# EAGLE design uno (EAGLE 9.2.2)
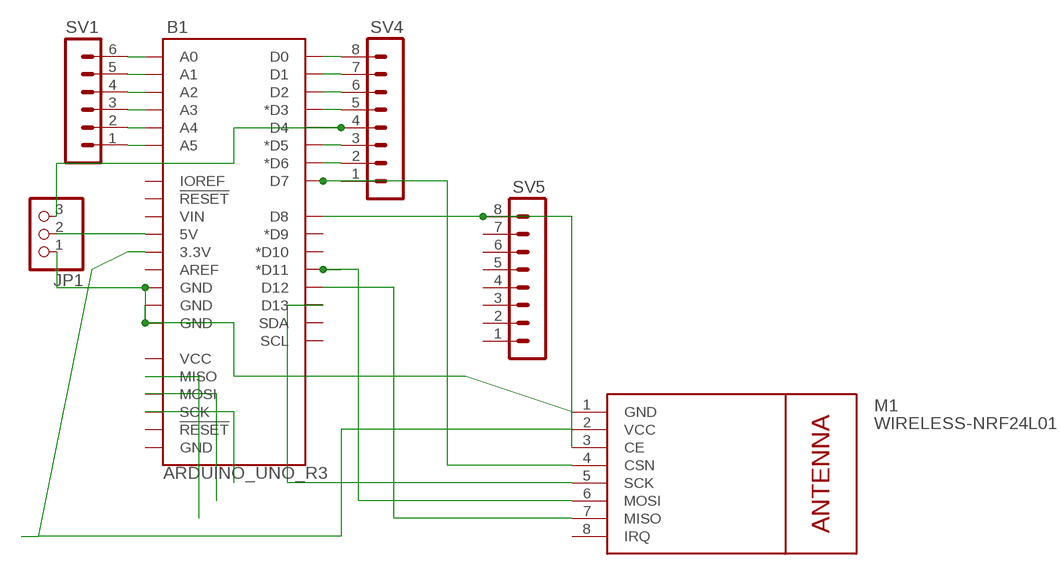
[diagram p0: schematic, sheet 1]

## Parts
B1  ARDUINO_UNO_R3  [ARDUINO_R3]
JP1  PINHD-1X3  [1X03]
M1  WIRELESS-NRF24L01  [WIRELESS-NRF24L01]
SV1  MA06-1  [MA06-1]
SV4  MA08-1  [MA08-1]
SV5  MA08-1  [MA08-1]

## Nets
N$1: B1.A5 SV1.1
N$2: B1.A4 SV1.2
N$3: B1.A3 SV1.3
N$4: B1.A2 SV1.4
N$5: B1.A1 SV1.5
N$6: B1.A0 SV1.6
N$9: B1.SCK
N$10: B1.MOSI
N$11: B1.MISO
N$17: B1.3.3V M1.2(VCC)
N$20: B1.D13 M1.5(SCK)
N$21: B1.D11(*D11) M1.6(MOSI)
N$22: B1.D12 M1.7(MISO)
N$27: B1.5V JP1.2
N$28: B1.GND@2(GND) B1.GND@3(GND) B1.GND@4(GND) JP1.1 M1.1(GND)
N$29: B1.D8 M1.3(CE) SV5.8
N$30: B1.D7 M1.4(CSN) SV4.1
N$31: B1.D6(*D6) SV4.2
N$32: B1.D5(*D5) SV4.3
N$33: B1.D4 JP1.3 SV4.4
N$34: B1.D3(*D3) SV4.5
N$35: B1.D2 SV4.6
N$36: B1.D1 SV4.7
N$37: B1.D0 SV4.8
Unconnected: B1.AREF B1.D9(*D9) B1.D10(*D10) B1.GND@1(GND) B1.IOREF B1.RESET@1(!RESET!) B1.RESET@2(!RESET!) B1.SCL B1.SDA B1.VCC B1.VIN M1.8(IRQ) SV5.1 SV5.2 SV5.3 SV5.4 SV5.5 SV5.6 SV5.7

## Library data of the parts
B1 = Arduino:ARDUINO_UNO_R3: Arduino R3 Footprint with SPI header Arduino Uno R3 Compatible Footprint. Matches PCB size of the original board. SparkFun Products: SAMD21 Dev Breakout <https://www.sparkfun.com/products/13672> RedBoard <https://www.sparkfun.com/products/12757> R3 Stackable Headers <https://www.sparkfun.com/products/11417>
JP1 = pinhead:PINHD-1X3: PIN HEADER
M1 = diy-modules:WIRELESS-NRF24L01: 2.4 GHz Wireless Module based on NRF24L01 chip More details available here: http://www.electrodragon.com/w/NRF24L01 Click here to find device on ebay.com <http://www.ebay.com/sch/nrf24l01+arduino>
SV1 = con-lstb:MA06-1: PIN HEADER; OC_FARNELL: unknown; OC_NEWARK: unknown
SV4 SV5 = con-lstb:MA08-1: PIN HEADER; OC_FARNELL: unknown; OC_NEWARK: unknown

## Board
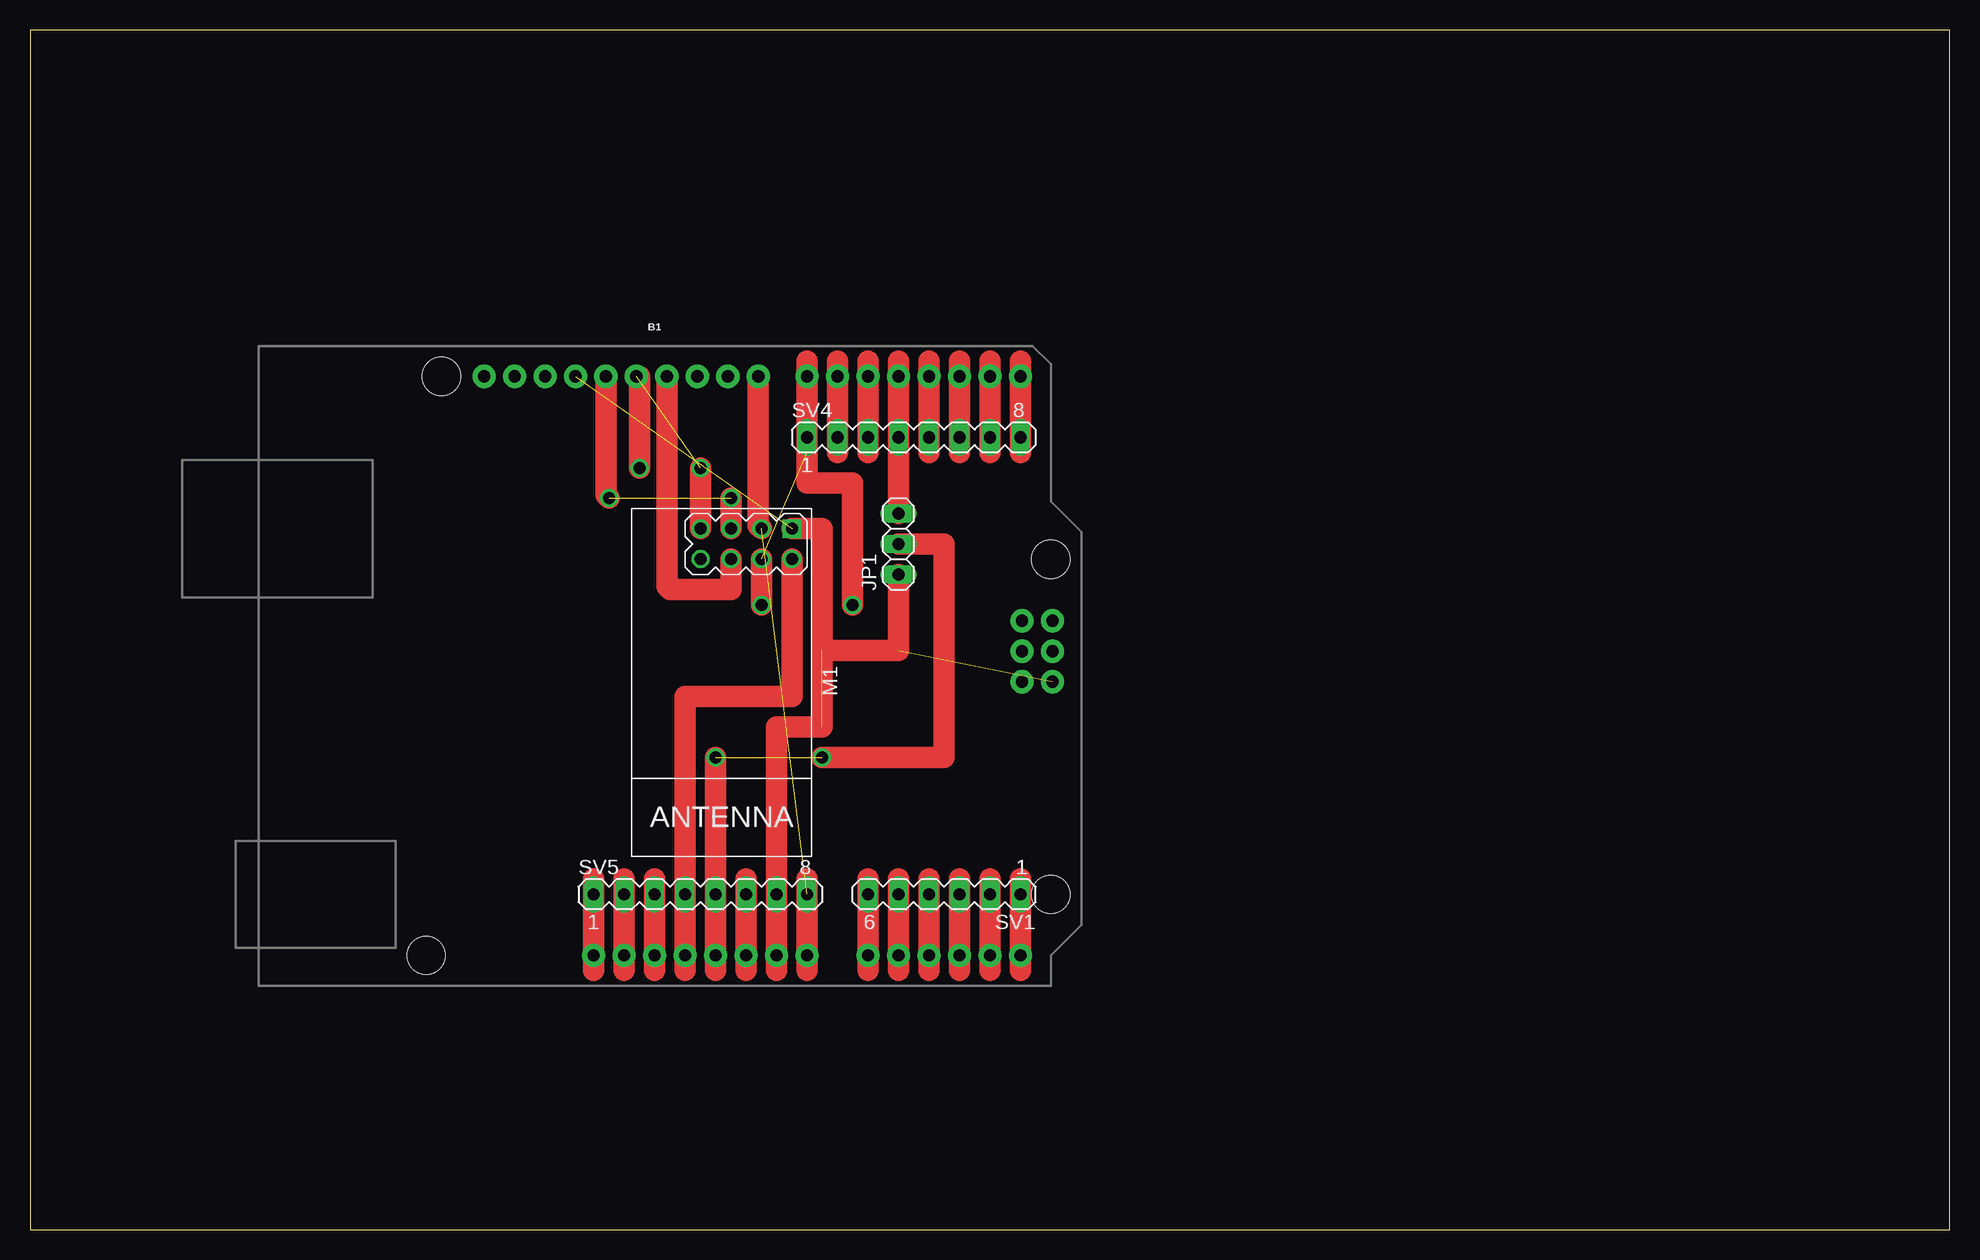
[diagram p1: board, top side]
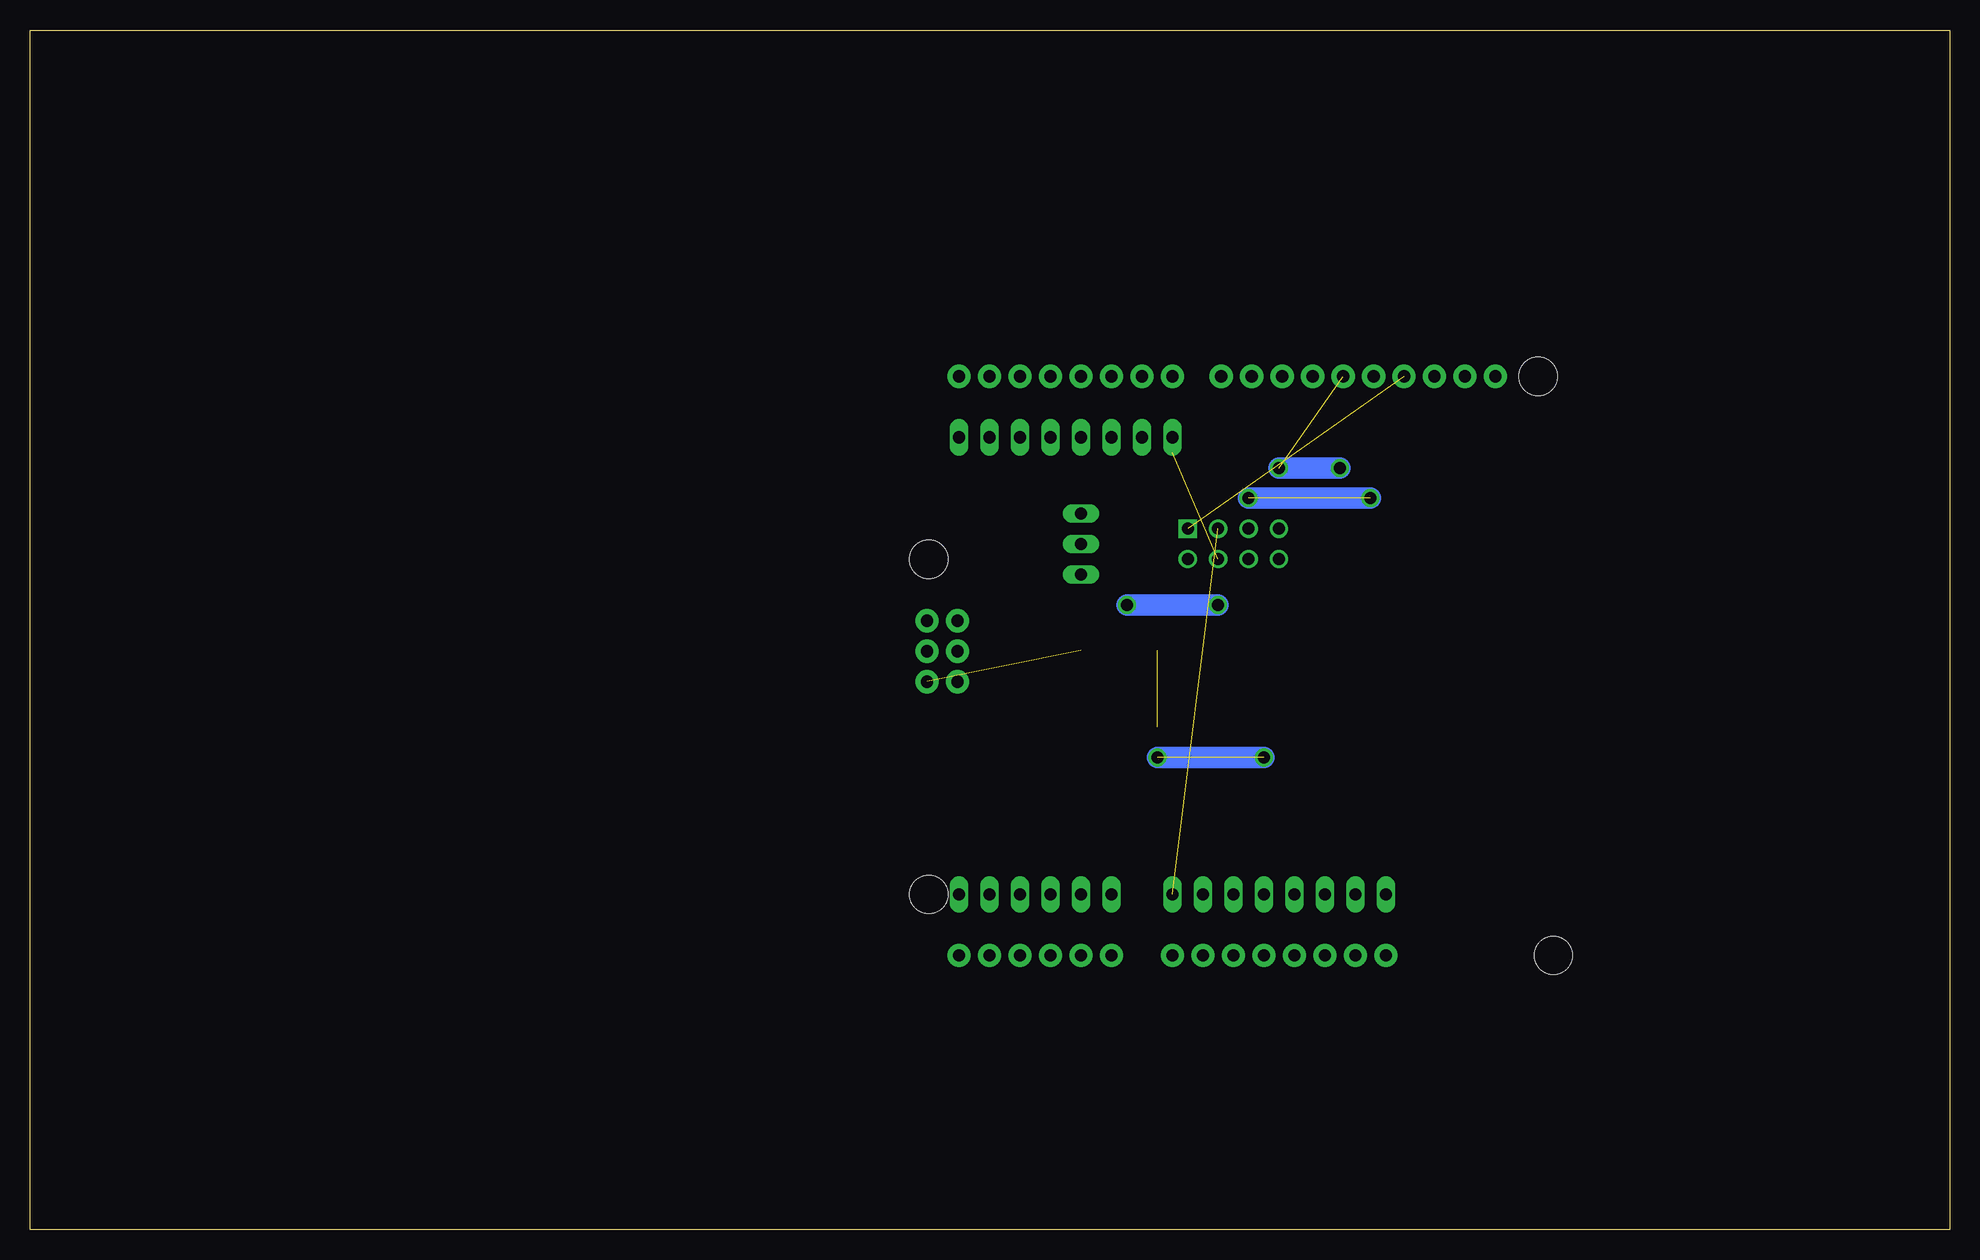
[diagram p2: board, bottom side, seen from below]

Size 160 x 100 mm. Coordinates in mm from the lower left corner, seen from the top.
Outline: 0,0 160,0 160,100 0,100 0,0
Copper layers (1*16): Top 0.035mm / dielectric 1.5mm / Bottom 0.035mm
Design rules "default": minimum track width 6mil, minimum drill 0.35mm, track to track 6mil, track to pad 6mil, pad to pad 6mil, via to via 6mil, smd to smd 6mil, copper to edge 40mil, drill to drill 6mil, minimum pad ring 10mil, minimum via ring 8mil, stop-mask expansion 4mil, vias tented up to drill 0mil, thermal gap 10mil

### Footprints (pad centres in the part's own frame; a part is rotated, then mirrored left to right if it is on the bottom)
ARDUINO_R3 = drill 1.016 pad 1.93: 3.3V 2.54,-24.13; 5V 5.08,-24.13; A0 17.78,-24.13; A1 20.32,-24.13; A2 22.86,-24.13; A3 25.4,-24.13; A4 27.94,-24.13; A5 30.48,-24.13; AREF -9.144,24.13; D0 30.48,24.13; D1 27.94,24.13; D2 25.4,24.13; D3 22.86,24.13; D4 20.32,24.13; D5 17.78,24.13; D6 15.24,24.13; D7 12.7,24.13; D8 8.636,24.13; D9 6.096,24.13; D10 3.556,24.13; D11 1.016,24.13; D12 -1.524,24.13; D13 -4.064,24.13; GND@1 7.62,-24.13; GND@2 10.16,-24.13; GND@3 -6.604,24.13; GND@4 33.16,-1.32; IOREF -2.54,-24.13; MISO 30.62,3.76; MOSI 33.16,1.22; NC -5.08,-24.13; RESET@1 0,-24.13; RESET@2 30.62,-1.32; SCK 30.62,1.22; SCL -14.224,24.13; SDA -11.684,24.13; VCC 33.16,3.76; VIN 12.7,-24.13 | hole 3.175: -17.78,24.13; 33.02,8.89; 33.02,-19.05; -19.05,-24.13
1X03 = drill 1.016 long: 1 -2.54,0; 2 0,0; 3 2.54,0
WIRELESS-NRF24L01 = drill 1 square: 1 -12.7,6.35 | drill 1: 2 -10.16,6.35; 3 -12.7,3.81; 4 -10.16,3.81; 5 -12.7,1.27; 6 -10.16,1.27; 7 -12.7,-1.27; 8 -10.16,-1.27
MA06-1 = drill 1.016 long: 1 -6.35,0; 2 -3.81,0; 3 -1.27,0; 4 1.27,0; 5 3.81,0; 6 6.35,0
MA08-1 = drill 1.016 long: 1 -8.89,0; 2 -6.35,0; 3 -3.81,0; 4 -1.27,0; 5 1.27,0; 6 3.81,0; 7 6.35,0; 8 8.89,0

### Placement (x,y rotation side)
B1  52.07,46.99 0 top
JP1  72.39,57.15 90 top
M1  57.15,45.72 270 top
SV1  76.2,27.94 180 top
SV4  73.66,66.04 0 top
SV5  55.88,27.94 0 top

### Tracks (layer width: path | path; a pad name or v marks a point on that pad's centre or on a via)
N$1
  Top 1.778: 82.55,29.21 SV1.1 B1.A5 82.55,21.59
N$2
  Top 1.778: 80.01,21.59 B1.A4 SV1.2 80.01,29.21
N$3
  Top 1.778: 77.47,29.21 SV1.3 B1.A3 77.47,21.59
N$4
  Top 1.778: 74.93,21.59 B1.A2 SV1.4 74.93,29.21
N$5
  Top 1.778: 72.39,21.59 B1.A1 SV1.5 72.39,29.21
N$6
  Top 1.778: 69.85,29.21 SV1.6 B1.A0 69.85,21.59
N$7
  Top 1.778: 64.77,21.59 64.77,29.21
N$8
  Top 1.778: 62.23,29.21 62.23,21.59
N$12
  Top 1.778: 59.69,21.59 59.69,29.21
N$14
  Top 1.778: 57.15,29.21 57.15,27.94 57.15,21.59
N$15
  Top 1.778: 54.61,21.59 54.61,29.21
N$16
  Top 1.778: 52.07,29.21 52.07,21.59
N$17
  Top 1.778: M1.2 63.5,44.45 54.61,44.45 B1.3.3V
N$18
  Top 1.778: 49.53,21.59 49.53,29.21
N$19
  Top 1.778: 46.99,29.21 46.99,21.59
N$20  (via drill 1)  (1 unrouted)
  Top 1.778: B1.D13 48.01,61.21 v48.26,60.96 | M1.5 58.42,60.96
N$21
  Top 1.778: M1.6 58.42,53.34 53.34,53.34 53.09,53.59 B1.D11
N$22  (via drill 1)  (1 unrouted)
  Top 1.778: M1.7 v55.88,63.5
N$23  (via drill 1)
  Bottom 1.778: v58.42,60.96 48.26,60.96
N$24  (via drill 1)
  Top 1.778: v50.8,63.5 50.8,71.12
  Bottom 1.778: v50.8,63.5 55.88,63.5
N$25  (via drill 1)
  Bottom 1.778: v60.96,52.07 68.58,52.07
N$26  (via drill 1)
  Top 1.778: v68.58,52.07 68.58,62.23 64.77,62.23 64.77,71.12
N$27  (via drill 1)  (1 unrouted)
  Top 1.778: B1.5V v57.15,39.37 | 66.04,39.37 76.2,39.37 76.2,57.15 JP1.2
N$28  (3 unrouted)
  Top 1.778: JP1.1 72.39,48.26 66.04,48.26 | M1.1 66.04,58.42 66.04,41.91 62.23,41.91 B1.GND@2
N$29  (1 unrouted)
  Top 1.778: M1.3 60.71,58.67 B1.D8
N$30  (1 unrouted)
  Top 1.778: 64.77,64.77 SV4.1 B1.D7 64.77,72.39 | M1.4 60.96,52.07
N$31
  Top 1.778: 67.31,72.39 B1.D6 SV4.2 67.31,64.77
N$32
  Top 1.778: 69.85,64.77 SV4.3 B1.D5 69.85,72.39
N$33
  Top 1.778: SV4.4 72.39,64.77 | SV4.4 B1.D4 72.39,72.39 | SV4.4 JP1.3
N$34
  Top 1.778: 74.93,64.77 SV4.5 B1.D3 74.93,72.39
N$35
  Top 1.778: 77.47,64.77 SV4.6 B1.D2 77.47,72.39
N$36
  Top 1.778: 80.01,72.39 B1.D1 SV4.7 80.01,64.77
N$37
  Top 1.778: 82.55,64.77 SV4.8 B1.D0 82.55,72.39
N$38  (via drill 1)
  Bottom 1.778: v66.04,39.37 57.15,39.37